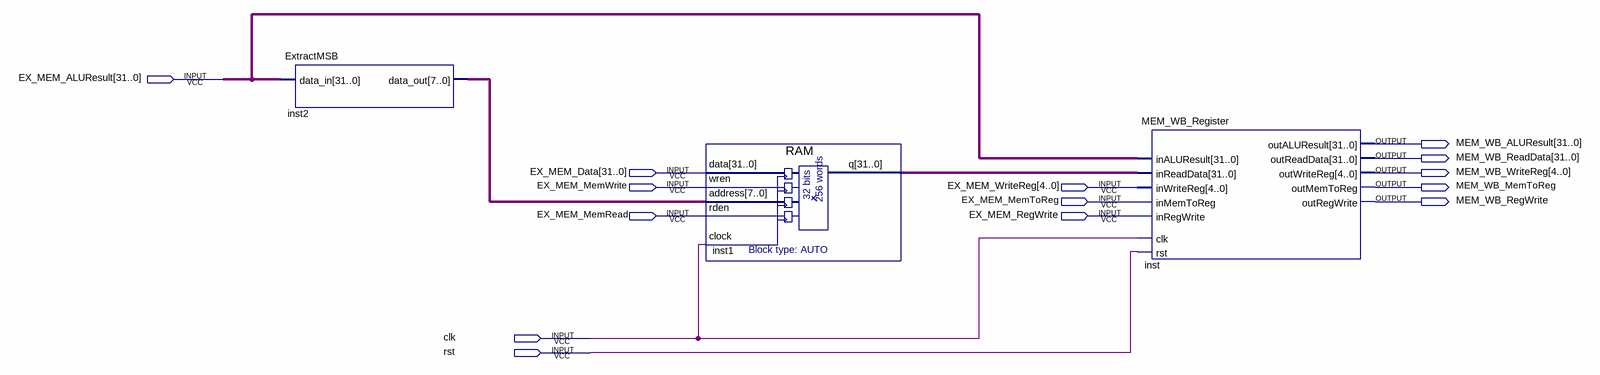
[diagram p0: schematic sheet]
// Quartus schematic Mem_Stage.bdf as structural Verilog: 3 symbols, 14 pins
module Mem_Stage (
  input  [31:0] EX_MEM_ALUResult,
  input  [31:0] EX_MEM_Data,
  input  EX_MEM_MemWrite,
  input  [4:0] EX_MEM_WriteReg,
  input  EX_MEM_MemToReg,
  input  EX_MEM_MemRead,
  input  EX_MEM_RegWrite,
  input  clk,
  input  rst,
  output [31:0] MEM_WB_ALUResult,
  output [31:0] MEM_WB_ReadData,
  output [4:0] MEM_WB_WriteReg,
  output MEM_WB_MemToReg,
  output MEM_WB_RegWrite
);

  wire [7:0] inst2_data_out;
  wire [31:0] inst1_q;

  ExtractMSB inst2 (.data_in(EX_MEM_ALUResult), .data_out(inst2_data_out));
  RAM inst1 (
    .data(EX_MEM_Data), .wren(EX_MEM_MemWrite), .address(inst2_data_out), .rden(EX_MEM_MemRead), .clock(clk),
    .q(inst1_q));
  MEM_WB_Register inst (
    .clk(clk), .rst(rst), .inALUResult(EX_MEM_ALUResult), .inReadData(inst1_q), .inWriteReg(EX_MEM_WriteReg),
    .inMemToReg(EX_MEM_MemToReg), .inRegWrite(EX_MEM_RegWrite), .outALUResult(MEM_WB_ALUResult),
    .outReadData(MEM_WB_ReadData), .outWriteReg(MEM_WB_WriteReg), .outMemToReg(MEM_WB_MemToReg),
    .outRegWrite(MEM_WB_RegWrite));
endmodule
